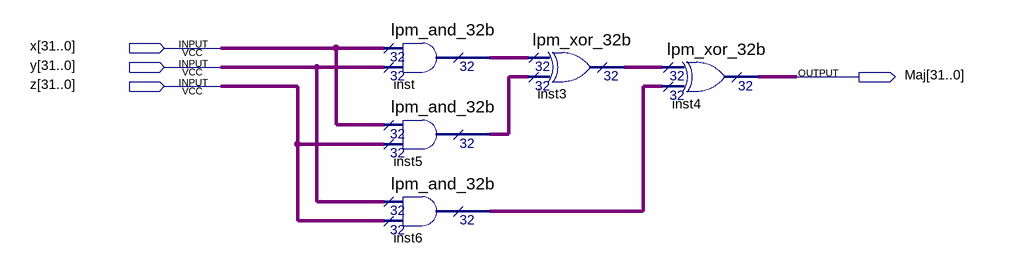
[diagram p0: schematic sheet]
// Quartus schematic Maj.bdf as structural Verilog: 5 symbols, 4 pins
module Maj (
  input  [31:0] x,
  input  [31:0] y,
  input  [31:0] z,
  output [31:0] Maj
);

  wire [31:0] inst3_result, inst5_result, inst6_result, inst_result;

  lpm_and_32b inst (.data0x(x), .data1x(y), .result(inst_result));
  lpm_and_32b inst5 (.data0x(x), .data1x(z), .result(inst5_result));
  lpm_and_32b inst6 (.data0x(y), .data1x(z), .result(inst6_result));
  lpm_xor_32b inst3 (.data0x(inst_result), .data1x(inst5_result), .result(inst3_result));
  lpm_xor_32b inst4 (.data0x(inst3_result), .data1x(inst6_result), .result(Maj));
endmodule
